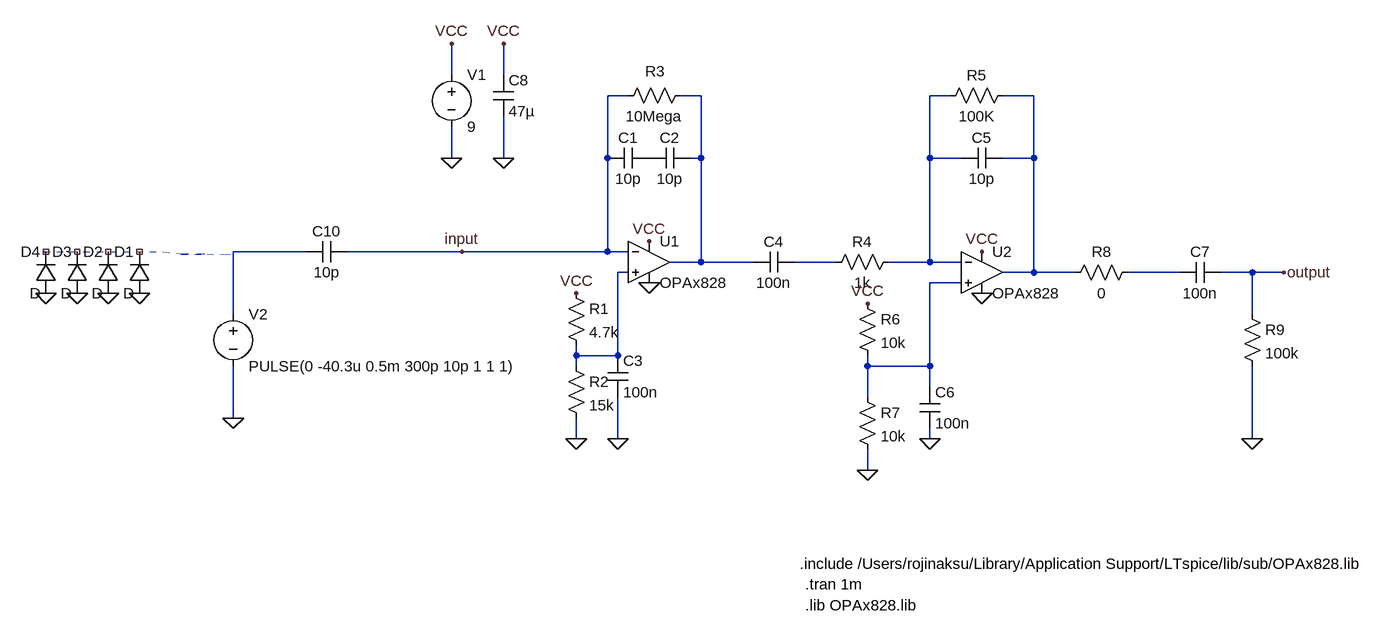
[diagram p0: schematic detector_test2.asc]
detector_test2.asc, the LTspice schematic file:
Version 4
SHEET 1 1252 1472
WIRE -176 16 -176 -32
WIRE -96 16 -96 -32
WIRE 96 48 64 48
WIRE 208 48 176 48
WIRE 592 48 560 48
WIRE 720 48 672 48
WIRE -176 144 -176 96
WIRE -96 144 -96 80
WIRE 64 144 64 48
WIRE 208 144 208 48
WIRE 208 144 192 144
WIRE 560 144 560 48
WIRE 608 144 560 144
WIRE 720 144 720 48
WIRE 720 144 672 144
WIRE -400 288 -512 288
WIRE -160 288 -336 288
WIRE 64 288 64 144
WIRE 64 288 -160 288
WIRE 96 288 64 288
WIRE 208 304 208 144
WIRE 208 304 160 304
WIRE 288 304 208 304
WIRE 416 304 352 304
WIRE 560 304 560 144
WIRE 560 304 496 304
WIRE 608 304 560 304
WIRE 96 320 80 320
WIRE 720 320 720 144
WIRE 720 320 672 320
WIRE 784 320 720 320
WIRE 944 320 864 320
WIRE 1056 320 1008 320
WIRE 1104 320 1056 320
WIRE 608 336 560 336
WIRE -512 384 -512 288
WIRE 1056 384 1056 320
WIRE 16 448 16 432
WIRE 80 448 80 320
WIRE 80 448 16 448
WIRE 16 464 16 448
WIRE 464 464 464 448
WIRE 560 464 560 336
WIRE 560 464 464 464
WIRE 560 496 560 464
WIRE 464 512 464 464
WIRE -512 544 -512 464
WIRE 16 576 16 544
WIRE 80 576 80 512
WIRE 560 576 560 560
WIRE 1056 576 1056 464
WIRE 464 624 464 592
FLAG 16 576 0
FLAG 80 576 0
FLAG 128 336 0
FLAG 464 624 0
FLAG 560 576 0
FLAG 1056 576 0
FLAG 640 352 0
FLAG -96 144 0
FLAG -176 144 0
FLAG -176 -32 VCC
FLAG -96 -32 VCC
FLAG 16 352 VCC
FLAG 128 272 VCC
FLAG 464 368 VCC
FLAG 640 288 VCC
FLAG -160 288 input
FLAG 1104 320 output
FLAG -512 544 0
FLAG -800 352 0
FLAG -752 352 0
FLAG -704 352 0
FLAG -656 352 0
SYMBOL res 192 32 R90
WINDOW 0 -6 55 VBottom 2
WINDOW 3 32 56 VTop 2
SYMATTR InstName R3
SYMATTR Value 10Mega
SYMBOL cap 128 128 R90
WINDOW 0 0 32 VBottom 2
WINDOW 3 32 32 VTop 2
SYMATTR InstName C1
SYMATTR Value 10p
SYMBOL cap 192 128 R90
WINDOW 0 0 32 VBottom 2
WINDOW 3 32 32 VTop 2
SYMATTR InstName C2
SYMATTR Value 10p
SYMBOL cap 64 448 R0
SYMATTR InstName C3
SYMATTR Value 100n
SYMBOL res 0 448 R0
SYMATTR InstName R2
SYMATTR Value 15k
SYMBOL res 0 336 R0
SYMATTR InstName R1
SYMATTR Value 4.7k
SYMBOL res 512 288 R90
WINDOW 0 0 56 VBottom 2
WINDOW 3 32 56 VTop 2
SYMATTR InstName R4
SYMATTR Value 1k
SYMBOL res 880 304 R90
WINDOW 0 0 56 VBottom 2
WINDOW 3 32 56 VTop 2
SYMATTR InstName R8
SYMATTR Value 0
SYMBOL res 448 352 R0
SYMATTR InstName R6
SYMATTR Value 10k
SYMBOL res 448 496 R0
SYMATTR InstName R7
SYMATTR Value 10k
SYMBOL res 688 32 R90
WINDOW 0 0 56 VBottom 2
WINDOW 3 32 56 VTop 2
SYMATTR InstName R5
SYMATTR Value 100K
SYMBOL cap 352 288 R90
WINDOW 0 0 32 VBottom 2
WINDOW 3 32 32 VTop 2
SYMATTR InstName C4
SYMATTR Value 100n
SYMBOL cap 672 128 R90
WINDOW 0 0 32 VBottom 2
WINDOW 3 32 32 VTop 2
SYMATTR InstName C5
SYMATTR Value 10p
SYMBOL cap 544 496 R0
SYMATTR InstName C6
SYMATTR Value 100n
SYMBOL cap 1008 304 R90
WINDOW 0 0 32 VBottom 2
WINDOW 3 32 32 VTop 2
SYMATTR InstName C7
SYMATTR Value 100n
SYMBOL res 1040 368 R0
SYMATTR InstName R9
SYMATTR Value 100k
SYMBOL voltage -176 0 R0
SYMATTR InstName V1
SYMATTR Value 9
SYMBOL cap -112 16 R0
SYMATTR InstName C8
SYMATTR Value 47µ
SYMBOL OpAmps/TLE2072 128 240 R0
SYMATTR InstName U1
SYMATTR Value OPAx828
SYMBOL OpAmps/TLE2072 640 256 R0
SYMATTR InstName U2
SYMATTR Value OPAx828
SYMBOL Voltage -512 368 R0
SYMATTR InstName V2
SYMATTR Value PULSE(0 -40.3u 0.5m 300p 10p 1 1 1)
SYMBOL Cap -336 272 R90
WINDOW 0 0 32 VBottom 2
WINDOW 3 32 32 VTop 2
SYMATTR InstName C10
SYMATTR Value 10p
SYMBOL diode -640 352 R180
WINDOW 0 24 64 Left 2
WINDOW 3 24 0 Left 2
SYMATTR InstName D1
SYMBOL diode -688 352 R180
WINDOW 0 24 64 Left 2
WINDOW 3 24 0 Left 2
SYMATTR InstName D2
SYMBOL diode -736 352 R180
WINDOW 0 24 64 Left 2
WINDOW 3 24 0 Left 2
SYMATTR InstName D3
SYMBOL diode -784 352 R180
WINDOW 0 24 64 Left 2
WINDOW 3 24 0 Left 2
SYMATTR InstName D4
TEXT 360 768 Left 2 !.include /Users/rojinaksu/Library/Application Support/LTspice/lib/sub/OPAx828.lib
TEXT 368 800 Left 2 !.tran 1m
TEXT 368 832 Left 2 !.lib OPAx828.lib
LINE Normal -800 288 -804 288 2
LINE Normal -804 288 -620 288 2
LINE Normal -620 288 -588 292 2
LINE Normal -556 292 -592 292 2
LINE Normal -592 292 -532 292 2
LINE Normal -532 292 -516 292 2

The netlist it stands for:
* detector_test2.asc
R3 N001 input 10Mega
C1 P001 input 10p
C2 N001 P001 10p
C3 N006 0 100n
R2 N006 0 15k
R1 VCC N006 4.7k
R4 N002 N005 1k
R8 N007 N003 0
R6 VCC N008 10k
R7 N008 0 10k
R5 N003 N002 100K
C4 N005 N001 100n
C5 N003 N002 10p
C6 N008 0 100n
C7 output N007 100n
R9 output 0 100k
V1 VCC 0 9
C8 VCC 0 47µ
XU1 N006 input VCC 0 N001 OPAx828  ; pins In+ In- V+ V- OUT
XU2 N008 N002 VCC 0 N003 OPAx828  ; pins In+ In- V+ V- OUT
V2 N004 0 PULSE(0 -40.3u 0.5m 300p 10p 1 1 1)
C10 input N004 10p
D1 0 NC_01 D
D2 0 NC_02 D
D3 0 NC_03 D
D4 0 NC_04 D
.model D D
.lib standard.dio
.include /Users/rojinaksu/Library/Application Support/LTspice/lib/sub/OPAx828.lib
.tran 1m
.lib OPAx828.lib
.backanno
.end